# EAGLE schematic FFC_pcb_v1_double_layer (EAGLE 9.2.0)
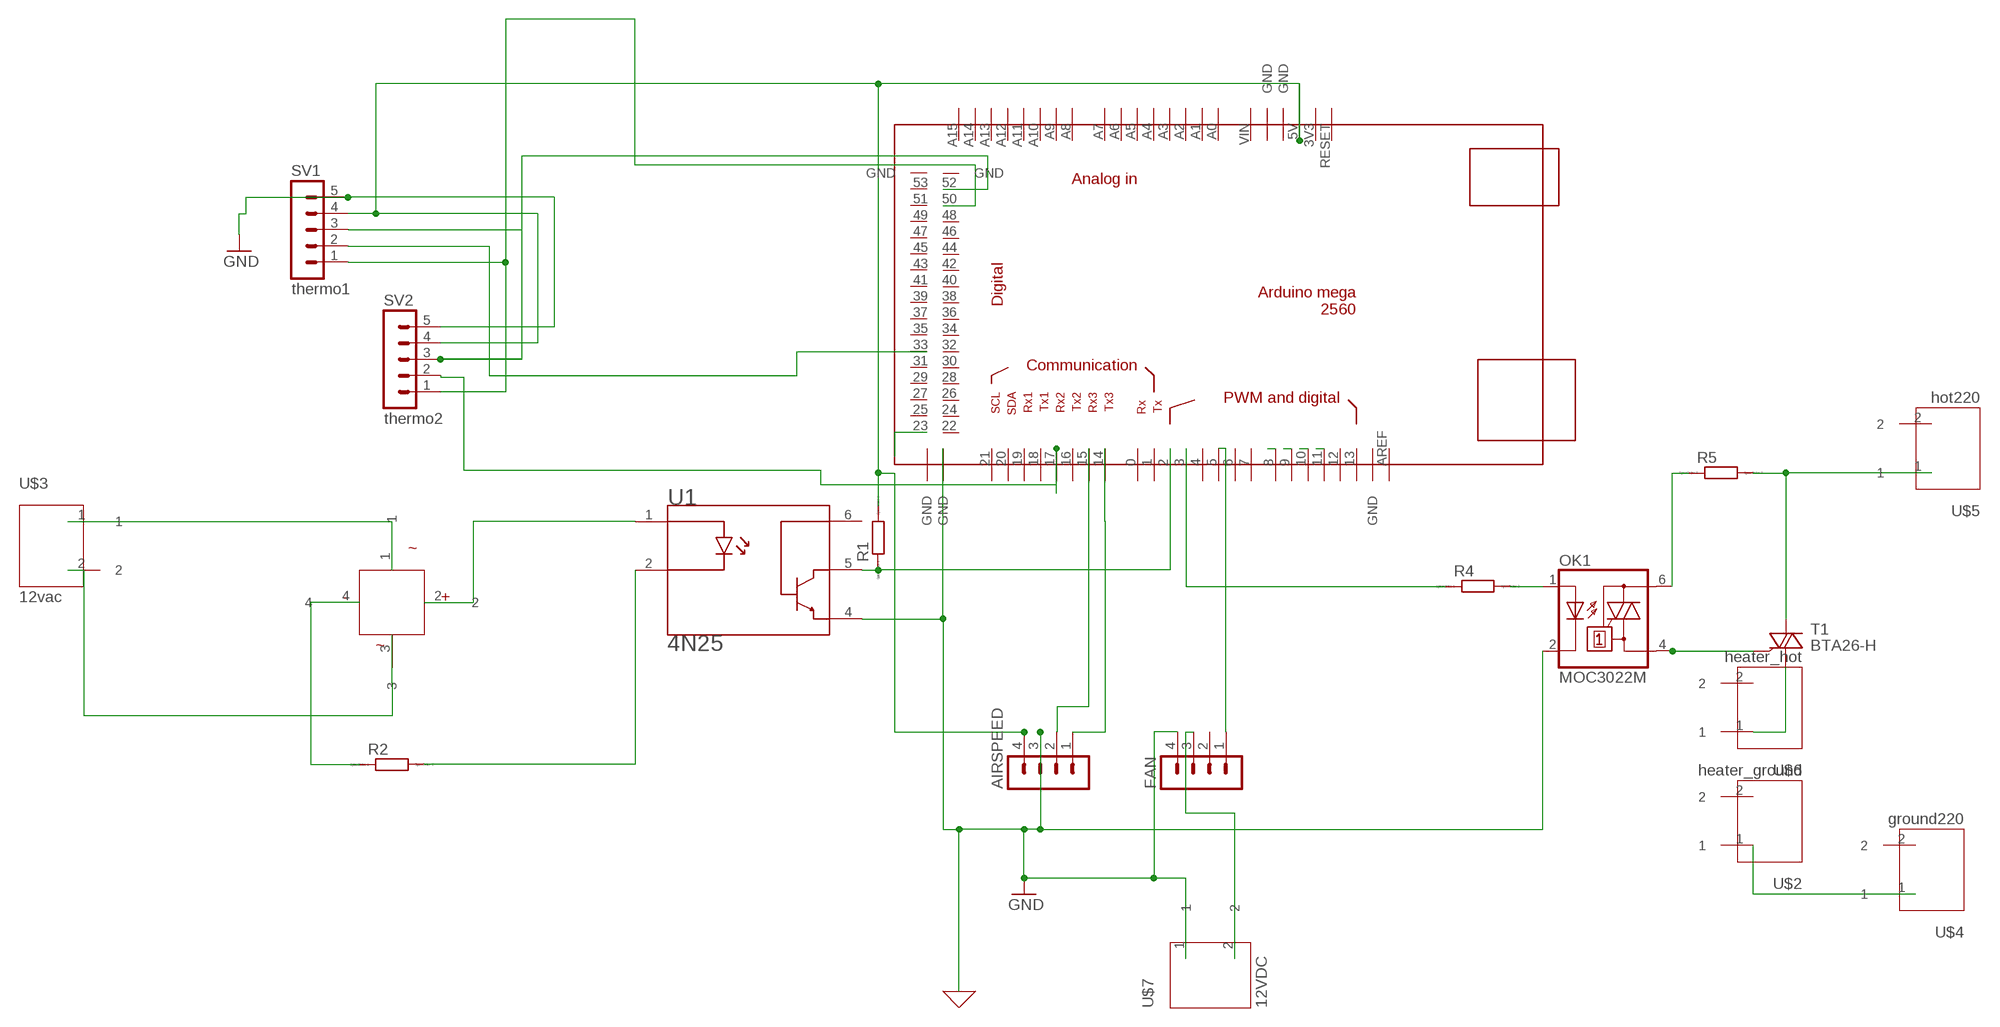
[diagram p0: schematic, sheet 1]

## Parts
AIRSPEED  MA04-1  [MA04-1]
FAN  MA04-1  [MA04-1]
OK1  MOC3022M  [DIL06]
R1  R0204/7  [0204/7]
R2  R0204/7  [0204/7]
R4  R0204/7  [0204/7]
R5  R0204/7  [0204/7]
SV1  thermo1  MA05-1  [MA05-1]
SV2  thermo2  MA05-1  [MA05-1]
T1  BTA26-H  [TOP3L-1]
U1  4N25  [DIP762W50P254L712H400Q6N]
U$1  MEGA_DEVICE  [MEGABOX]
U$2  heater_ground  COVERED_TERMINAL  [COVERED_TERMINAL_2PINS]
U$3  12vac  COVERED_TERMINAL  [COVERED_TERMINAL_2PINS]
U$4  ground220  COVERED_TERMINAL  [COVERED_TERMINAL_2PINS]
U$5  hot220  COVERED_TERMINAL  [COVERED_TERMINAL_2PINS]
U$6  heater_hot  COVERED_TERMINAL  [COVERED_TERMINAL_2PINS]
U$7  12VDC  COVERED_TERMINAL  [COVERED_TERMINAL_2PINS]
U$8  BRIDGE  [BRIDGE]

## Nets
GND: AIRSPEED.3 FAN.4 OK1.2(C) SV1.5 SV2.5 U1.4(E) U$1.GND@4(GND) U$7.1
N$1: R1.1 U1.5(C) U$1.2
N$2: OK1.6(A2) R5.1
N$3: U1.1(A) U$8.2
N$4: R4.1 U$1.3
N$5: OK1.1(A) R4.2
N$6: R5.2 T1.A2 U$5.1
N$7: T1.A1 U$6.1
N$8: R2.1 U$8.4
N$9: OK1.4(A1) T1.G
N$10: U$2.1 U$4.1
N$11: U$3.1 U$8.1
N$12: U$3.2 U$8.3
N$13: R2.2 U1.2(K)
N$14: SV2.2 U$1.17
N$15: FAN.1 U$1.5
N$16: FAN.3 U$7.2
N$35: U$1.23
N$40: SV1.2 U$1.33
N$51: AIRSPEED.4 R1.2 SV1.4 SV2.4 U$1.5V
N$54: SV1.3 SV2.3 U$1.52
N$58: AIRSPEED.2 U$1.15
N$59: AIRSPEED.1 U$1.14
N$66: U$1.8
N$67: U$1.9
N$68: U$1.10
N$69: U$1.11
N$70: SV1.1 SV2.1 U$1.50
Unconnected: FAN.2 U1.6(B) U$1.0 U$1.1 U$1.3V3 U$1.4 U$1.6 U$1.7 U$1.12 U$1.13 U$1.16 U$1.18 U$1.19 U$1.20 U$1.21 U$1.22 U$1.24 U$1.25 U$1.26 U$1.27 U$1.28 U$1.29 U$1.30 U$1.31 U$1.32 U$1.34 U$1.35 U$1.36 U$1.37 U$1.38 U$1.39 U$1.40 U$1.41 U$1.42 U$1.43 U$1.44 U$1.45 U$1.46 U$1.47 U$1.48 U$1.49 U$1.51 U$1.53 U$1.A0 U$1.A1 U$1.A2 U$1.A3 U$1.A4 U$1.A5 U$1.A6 U$1.A7 U$1.A8 U$1.A9 U$1.A10 U$1.A11 U$1.A12 U$1.A13 U$1.A14 U$1.A15 U$1.AREF U$1.GND@1(GND) U$1.GND@2(GND) U$1.GND@3(GND) U$1.GND@5(GND) U$1.GND@6(GND) U$1.GND@7(GND) U$1.RESET U$1.VIN U$2.2 U$4.2 U$5.2 U$6.2

## Library data of the parts
AIRSPEED FAN = con-lstb:MA04-1: PIN HEADER; OC_FARNELL: unknown; OC_NEWARK: unknown
OK1 = optocoupler:MOC30*M: RANDOM-PHASE OPTOISOLATORS TRIAC DRIVER OUTPUT Source: http://www.fairchildsemi.com MOC3020-M.pdf; MF: FAIRCHILD SEMICONDUCTOR; MPN: MOC3022-M; OC_FARNELL: 1021086; OC_NEWARK: 58K1956
R1 R2 R4 R5 = eagle-ltspice:R: RESISTOR, European symbol; SPICEMODEL: NONE; SPICEPREFIX: R
SV1 SV2 = con-lstb:MA05-1: PIN HEADER; OC_FARNELL: unknown; OC_NEWARK: unknown
T1 = triac:BTA26: 25A TRIAC Source: http://www.st.com/stonline/products/literature/ds/7470.pdf
U1 = 4N25:4N25: Optoisolator, Transistor Output; AVAILABILITY: Unavailable; DESCRIPTION: Optocoupler DC-IN 1-CH Transistor With Base DC-OUT 6-Pin PDIP; MF: Vishay Semiconductor; MP: 4N25; PACKAGE: DIP-6 Lite-On; PRICE: None
U$1 = ArduinoMegaSymbol:MEGA_DEVICE: mega card as device
U$2-U$7 = gh_library:COVERED_TERMINAL
U$8 = gh_library:BRIDGE